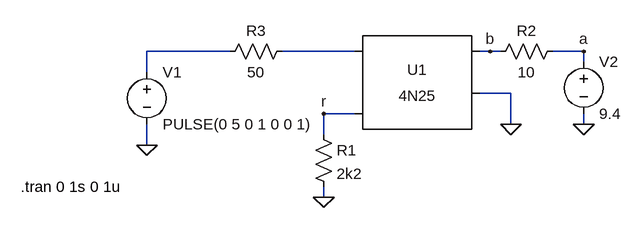
[diagram p0: schematic optp-ctr.asc]
optp-ctr.asc, the LTspice schematic file:
Version 4
SHEET 1 880 680
WIRE -96 128 -224 128
WIRE 96 128 -16 128
WIRE 304 128 288 128
WIRE 320 128 304 128
WIRE 448 128 400 128
WIRE 448 144 448 128
WIRE -224 160 -224 128
WIRE 336 192 288 192
WIRE 96 224 48 224
WIRE 336 240 336 192
WIRE 448 240 448 224
WIRE 48 256 48 224
WIRE -224 272 -224 240
WIRE 48 352 48 336
FLAG -224 272 0
FLAG 336 240 0
FLAG 448 240 0
FLAG 448 128 a
FLAG 304 128 b
FLAG 48 352 0
FLAG 48 224 r
SYMBOL Optos\\4N25 192 192 R0
SYMATTR InstName U1
SYMBOL voltage -224 144 R0
WINDOW 123 0 0 Left 0
WINDOW 39 0 0 Left 0
SYMATTR InstName V1
SYMATTR Value PULSE(0 5 0 1 0 0 1)
SYMBOL res 416 112 R90
WINDOW 0 0 56 VBottom 2
WINDOW 3 32 56 VTop 2
SYMATTR InstName R2
SYMATTR Value 10
SYMBOL voltage 448 128 R0
WINDOW 123 0 0 Left 0
WINDOW 39 0 0 Left 0
SYMATTR InstName V2
SYMATTR Value 9.4
SYMBOL res 0 112 R90
WINDOW 0 0 56 VBottom 2
WINDOW 3 32 56 VTop 2
SYMATTR InstName R3
SYMATTR Value 50
SYMBOL res 32 240 R0
SYMATTR InstName R1
SYMATTR Value 2k2
TEXT -418 336 Left 2 !.tran 0 1s 0 1u

The netlist it stands for:
* optp-ctr.asc
XU1 N002 r b 0 NC_01 4N25
V1 N001 0 PULSE(0 5 0 1 0 0 1)
R2 a b 10
V2 a 0 9.4
R3 N002 N001 50
R1 r 0 2k2
.tran 0 1s 0 1u
.lib 4N25.sub
.backanno
.end